# Altium schematic sheet SCH_Mach_nguyen_ly_thiet_ke.schdoc
size 382 x 213 mm
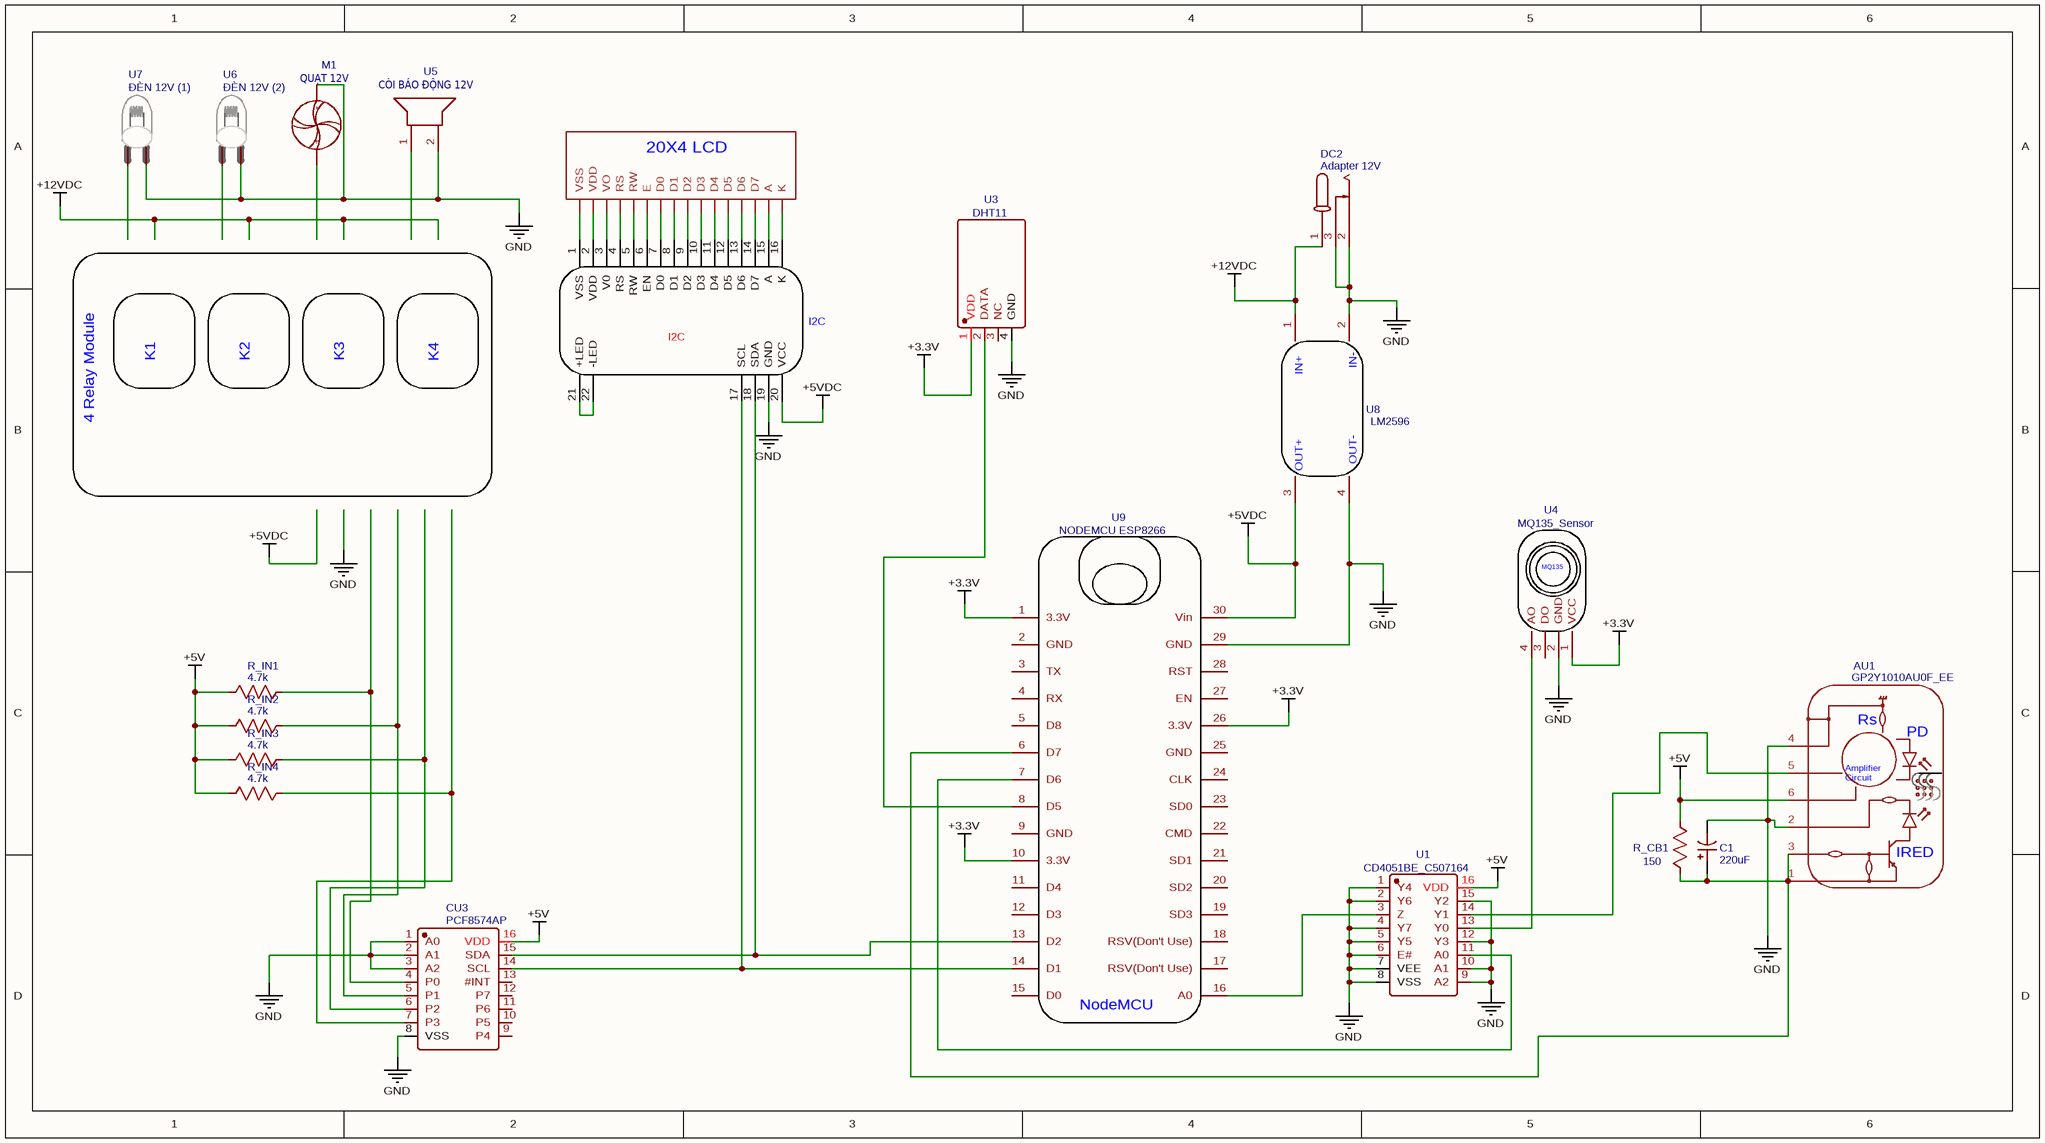
[diagram p0: SCH_Mach_nguyen_ly_thiet_ke.schdoc]

## Parts
AU1  GP2Y1010AU0F_EE  [GP2Y1010AU0F]
C1  220uF  [CAP-TH_BD10.0-P5.00-D0.6-FD]
CU3  PCF8574AP  [DIP-16_L19.2-W6.6-P2.54-LS7.6-BL]
DC2  Adapter 12V  [DC-IN-TH_DC005]
I2C  PCF8574AT I2C LCD1602 DRIVER  [PCF8574AT I2C LCD1602 DRIVER 2]  (value not drawn)
M1  QUẠT 12V
R_CB1  150  [R_AXIAL-0.5]
R_IN1  4.7k  [R_AXIAL-0.5]
R_IN2  4.7k  [R_AXIAL-0.5]
R_IN3  4.7k  [R_AXIAL-0.5]
R_IN4  4.7k  [R_AXIAL-0.5]
TUNNU2  LCD-16X28X2-KIT  [LCD-8X2-KIT]  (value not drawn)
U1  CD4051BE_C507164  [DIP-16_L20.0-W6.4-P2.54-LS7.6-BL]
U3  DHT11  [SENSOR-TH_DHT11]
U4  MQ135_Sensor  [MQ135_MODULO]
U5  CÒI BÁO ĐỘNG 12V  [BUZ-TH_BD22.0-P10.00_BUZZER_PIEZO_HX-2212]
U6  ĐÈN 12V (2)  [UNIVIBE LAMP-LDR ARRANGEMENT_LAMP]
U7  ĐÈN 12V (1)  [UNIVIBE LAMP-LDR ARRANGEMENT_LAMP]
U8  LM2596  [LM2596DC_DC]
U9  NODEMCU ESP8266  [ESP12E_DEVKIT-V1]

## Nets
+3.3V: U3.1(VDD) U4.1(VCC) U9.1(3.3V) U9.10(3.3V) U9.26(3.3V)
+5V: AU1.6(VCC) CU3.16(VDD) R_CB1.2 R_IN1.1 R_IN2.1 R_IN3.1 R_IN4.1 U1.16(VDD)
+5VDC: I2C.20(VCC) U8.3 U9.30(Vin)
+12VDC: DC2.1 U8.1
GND: AU1.2(LEDGND) AU1.4(SGND) C1.2 CU3.1(A0) CU3.2(A1) CU3.3(A2) CU3.8(VSS) DC2.2 DC2.3 I2C.19(GND) M1.2(-) U1.1(Y4) U1.2(Y6) U1.4(Y7) U1.5(Y5) U1.6(E#) U1.7(VEE) U1.8(VSS) U1.9(A2) U1.10(A1) U1.12(Y3) U1.15(Y2) U3.4(GND) U4.2(GND) U5.2 U6.2 U7.2 U8.2 U8.4 U9.29(GND)
NetAU1_1: AU1.1(VLED) AU1.3(LED) C1.1 R_CB1.1 U9.6(D7)
NetAU1_5: AU1.5(VO) U1.14(Y1)
NetCU3_4: CU3.4(P0) R_IN1.2
NetCU3_5: CU3.5(P1) R_IN2.2
NetCU3_6: CU3.6(P2) R_IN3.2
NetCU3_7: CU3.7(P3) R_IN4.2
NetCU3_14: CU3.14(SCL) I2C.17(SCL) U9.14(D1)
NetCU3_15: CU3.15(SDA) I2C.18(SDA) U9.13(D2)
NetI2C_1: I2C.1(VSS) TUNNU2.1(VSS)
NetI2C_2: I2C.2(VDD) TUNNU2.2(VDD)
NetI2C_3: I2C.3(V0) TUNNU2.3(VO)
NetI2C_4: I2C.4(RS) TUNNU2.4(RS)
NetI2C_5: I2C.5(RW) TUNNU2.5(RW)
NetI2C_6: I2C.6(EN) TUNNU2.6(E)
NetI2C_7: I2C.7(D0) TUNNU2.7(D0)
NetI2C_8: I2C.8(D1) TUNNU2.8(D1)
NetI2C_9: I2C.9(D2) TUNNU2.9(D2)
NetI2C_10: I2C.10(D3) TUNNU2.10(D3)
NetI2C_11: I2C.11(D4) TUNNU2.11(D4)
NetI2C_12: I2C.12(D5) TUNNU2.12(D5)
NetI2C_13: I2C.13(D6) TUNNU2.13(D6)
NetI2C_14: I2C.14(D7) TUNNU2.14(D7)
NetI2C_15: I2C.15(A) TUNNU2.15(A)
NetI2C_16: I2C.16(K) TUNNU2.16(K)
NetI2C_21: I2C.21(+LED) I2C.22(-LED)
NetU1_3: U1.3(Z) U9.16(A0)
NetU1_11: U1.11(A0) U9.7(D6)
NetU1_13: U1.13(Y0) U4.4(AO)
NetU3_2: U3.2(DATA) U9.8(D5)

Not connected (* = marked no-connect by the designer): CU3 9(P4) 10(P5) 11(P6) 12(P7) 13(#INT); M1 1(+); U3 3(NC); U4 3(DO); U5 1; U6 1; U7 1; U9 2(GND) 3(TX) 4(RX) 5(D8) 9(GND) 11(D4) 12(D3) 15(D0) 17(RSV(Don't_Use)) 18(RSV(Don't_Use)) 19(SD3) 20(SD2) 21(SD1) 22(CMD) 23(SD0) 24(CLK) 25(GND) 27(EN) 28(RST)

## Notes on the sheet
- K1
- K2
- K3
- (near I2C) I2C
- 4 Relay Module
- K4
- (in symbol GP2Y1010AU0F_EE) Rs; PD; IRED; Amplifier / Circuit
- (in symbol LCD-16X28X2-KIT) 20X4 LCD
- (in symbol LM2596) IN-; IN+; OUT-; OUT+
- (in symbol MQ135_Sensor) MQ135
- (in symbol NODEMCU ESP8266) NodeMCU

## Library data of the parts
AU1 = GP2Y1010AU0F_EE: nameAlias: Model; sourceId: Gke7pjBhb; Contributor: Ahmed Maher; spicePre: X; timeStamp: 1473197257; link: https://cdn.sharpsde.com/fileadmin/products/Optoelectronics/Sensors/Specs/GP2Y1010AU0F_20Jul07_Spec_ED-05G124B.pdf; spiceSymbolName: FIXED_GP2Y1010AU0F_EE
C1 = 220uF: Manufacturer: ELNA(伊娜); Manufacturer Part: RFO-35V221MH3P#; nameAlias: Value; Contributor: lcsc; Supplier: LCSC; Supplier Part: C399650; JLCPCB Part Class: Extended Part; spicePre: C; spiceSymbolName: RFO-35V221MH3P#
CU3 = PCF8574AP: Manufacturer: HGSEMI; Contributor: LCSC; Supplier: LCSC; Supplier Part: C398072; Manufacturer Part: PCF8574AP; spicePre: U; spiceSymbolName: PCF8574AP
DC2 = Adapter 12V: Manufacturer: SOFNG; Manufacturer Part: DC005-2.0MM; Supplier: LCSC; Supplier Part: C111567; spicePre: D; spiceSymbolName: DC005-2.0MM
I2C = PCF8574AT I2C LCD1602 DRIVER: Contributor: 瀬戸口和広; spicePre: M; spiceSymbolName: PCF8574AT I2C LCD1602 DRIVER
M1 = QUẠT 12V: Contributor: KiCAD; license: https://www.gnu.org/licenses/lgpl-2.1.html; spicePre: M; spiceSymbolName: Fan_ALT
R_CB1 = 150: nameAlias: Value(Ω); Contributor: LCEDA_Lib; spicePre: R; spiceSymbolName: R_AXIAL-0.5_US
R_IN1-R_IN4 = 4.7k: nameAlias: Value(Ω); Contributor: LCEDA_Lib; spicePre: R; spiceSymbolName: R_AXIAL-0.5_US
TUNNU2 = LCD-16X28X2-KIT: Contributor: SparkFun; spicePre: U; spiceSymbolName: LCD-16X28X2-KIT
U1 = CD4051BE_C507164: Manufacturer: HGSEMI(华冠); Contributor: LCSC; Supplier: LCSC; Supplier Part: C507164; Manufacturer Part: CD4051BE; JLCPCB Part Class: Extended Part; spicePre: U; spiceSymbolName: CD4051BE_C507164
U3 = DHT11: Manufacturer: 广州奥松; Contributor: LCSC; Supplier: LCSC; Supplier Part: C117051; Manufacturer Part: DHT11; JLCPCB Part Class: Extended Part; spicePre: U; spiceSymbolName: DHT11
U4 = MQ135_Sensor: Contributor: rusiru5707; spicePre: U; spiceSymbolName: SCHLIB_MQ135_Sensor_2022-02-27
U5 = CÒI BÁO ĐỘNG 12V: Manufacturer: null; Manufacturer Part: HX-2212; Contributor: lcsc; Supplier: LCSC; Supplier Part: C9900023877; JLCPCB Part Class: Extended Part; link: https://lcsc.com/eda_search?q=C9900023877&%26type=1&ref=editor; spicePre: U; spiceSymbolName: HX-2212
U6 = ĐÈN 12V (2): Contributor: Erik Holm Nielsen; spicePre: U; spiceSymbolName: UV_Lamp-LDR arrangement_Lamp
U7 = ĐÈN 12V (1): Contributor: Erik Holm Nielsen; spicePre: U; spiceSymbolName: UV_Lamp-LDR arrangement_Lamp
U8 = LM2596: nameAlias: Model; catid: 20; Contributor: utk.pekerjaan; sim: true; spicePre: X; spiceSymbolName: LM2596
U9 = NODEMCU ESP8266: nameAlias: Model; Contributor: Milinda Bandara; sourceId: OGtr1ZXUS; sim: true; spicePre: X; timeStamp: 1458805415; spiceSymbolName: NODEMCU ESP8266